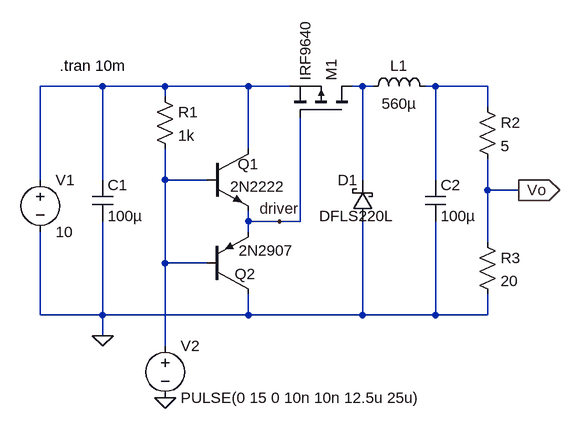
[diagram p0: schematic dc2dcbuck_b.asc]
dc2dcbuck_b.asc, the LTspice schematic file:
Version 4
SHEET 1 880 680
WIRE 48 0 -48 0
WIRE 144 0 48 0
WIRE 272 0 144 0
WIRE 336 0 272 0
WIRE 448 0 432 0
WIRE 464 0 448 0
WIRE 560 0 544 0
WIRE 640 0 560 0
WIRE 144 16 144 0
WIRE 640 32 640 0
WIRE 272 96 272 0
WIRE -48 144 -48 0
WIRE 48 144 48 0
WIRE 144 144 144 96
WIRE 208 144 144 144
WIRE 448 144 448 0
WIRE 560 144 560 0
WIRE 640 160 640 112
WIRE 688 160 640 160
WIRE 272 208 272 192
WIRE 320 208 272 208
WIRE 352 208 352 48
WIRE 352 208 320 208
WIRE 272 224 272 208
WIRE 640 240 640 160
WIRE 144 272 144 144
WIRE 208 272 144 272
WIRE -48 352 -48 224
WIRE 48 352 48 208
WIRE 48 352 -48 352
WIRE 272 352 272 320
WIRE 272 352 48 352
WIRE 448 352 448 208
WIRE 448 352 272 352
WIRE 560 352 560 208
WIRE 560 352 448 352
WIRE 640 352 640 320
WIRE 640 352 560 352
WIRE 48 384 48 352
WIRE 144 400 144 272
FLAG 688 160 Vo
IOPIN 688 160 Out
FLAG 144 480 0
FLAG 48 384 0
FLAG 320 208 driver
SYMBOL voltage -48 128 R0
WINDOW 123 0 0 Left 0
WINDOW 39 0 0 Left 0
SYMATTR InstName V1
SYMATTR Value 10
SYMBOL cap 32 144 R0
SYMATTR InstName C1
SYMATTR Value 100µ
SYMBOL res 128 0 R0
SYMATTR InstName R1
SYMATTR Value 1k
SYMBOL npn 208 96 R0
WINDOW 0 48 24 Left 2
WINDOW 3 36 58 Left 2
SYMATTR InstName Q1
SYMATTR Value 2N2222
SYMBOL pnp 208 320 M180
WINDOW 0 43 31 Left 2
WINDOW 3 49 67 Left 2
SYMATTR InstName Q2
SYMATTR Value 2N2907
SYMBOL pmos 432 48 M270
SYMATTR InstName M1
SYMATTR Value IRF9640
SYMBOL schottky 464 208 R180
WINDOW 0 24 64 Left 2
WINDOW 3 -33 8 Left 2
SYMATTR InstName D1
SYMATTR Value DFLS220L
SYMATTR Description Diode
SYMATTR Type diode
SYMBOL ind 448 16 R270
WINDOW 0 32 56 VTop 2
WINDOW 3 5 56 VBottom 2
SYMATTR InstName L1
SYMATTR Value 560µ
SYMATTR SpiceLine Rser=.23
SYMBOL cap 544 144 R0
SYMATTR InstName C2
SYMATTR Value 100µ
SYMBOL res 624 16 R0
SYMATTR InstName R2
SYMATTR Value 5
SYMBOL res 624 224 R0
SYMATTR InstName R3
SYMATTR Value 20
SYMBOL voltage 144 384 R0
WINDOW 123 0 0 Left 0
WINDOW 39 0 0 Left 0
SYMATTR InstName V2
SYMATTR Value PULSE(0 15 0 10n 10n 12.5u 25u)
TEXT -18 -32 Left 2 !.tran 10m

The netlist it stands for:
* dc2dcbuck_b.asc
V1 N001 0 10
C1 N001 0 100µ
R1 N001 N004 1k
Q1 N001 N004 driver 0 2N2222
Q2 0 N004 driver 0 2N2907
M1 N002 driver N001 N001 IRF9640
D1 0 N002 DFLS220L
L1 N002 N003 560µ Rser=.23
C2 N003 0 100µ
R2 N003 Vo 5
R3 Vo 0 20
V2 N004 0 PULSE(0 15 0 10n 10n 12.5u 25u)
.model D D
.lib standard.dio
.model NPN NPN
.model PNP PNP
.lib standard.bjt
.model NMOS NMOS
.model PMOS PMOS
.lib standard.mos
.tran 10m
.backanno
.end